# Altium schematic sheet Radio_USB.schdoc
size A3
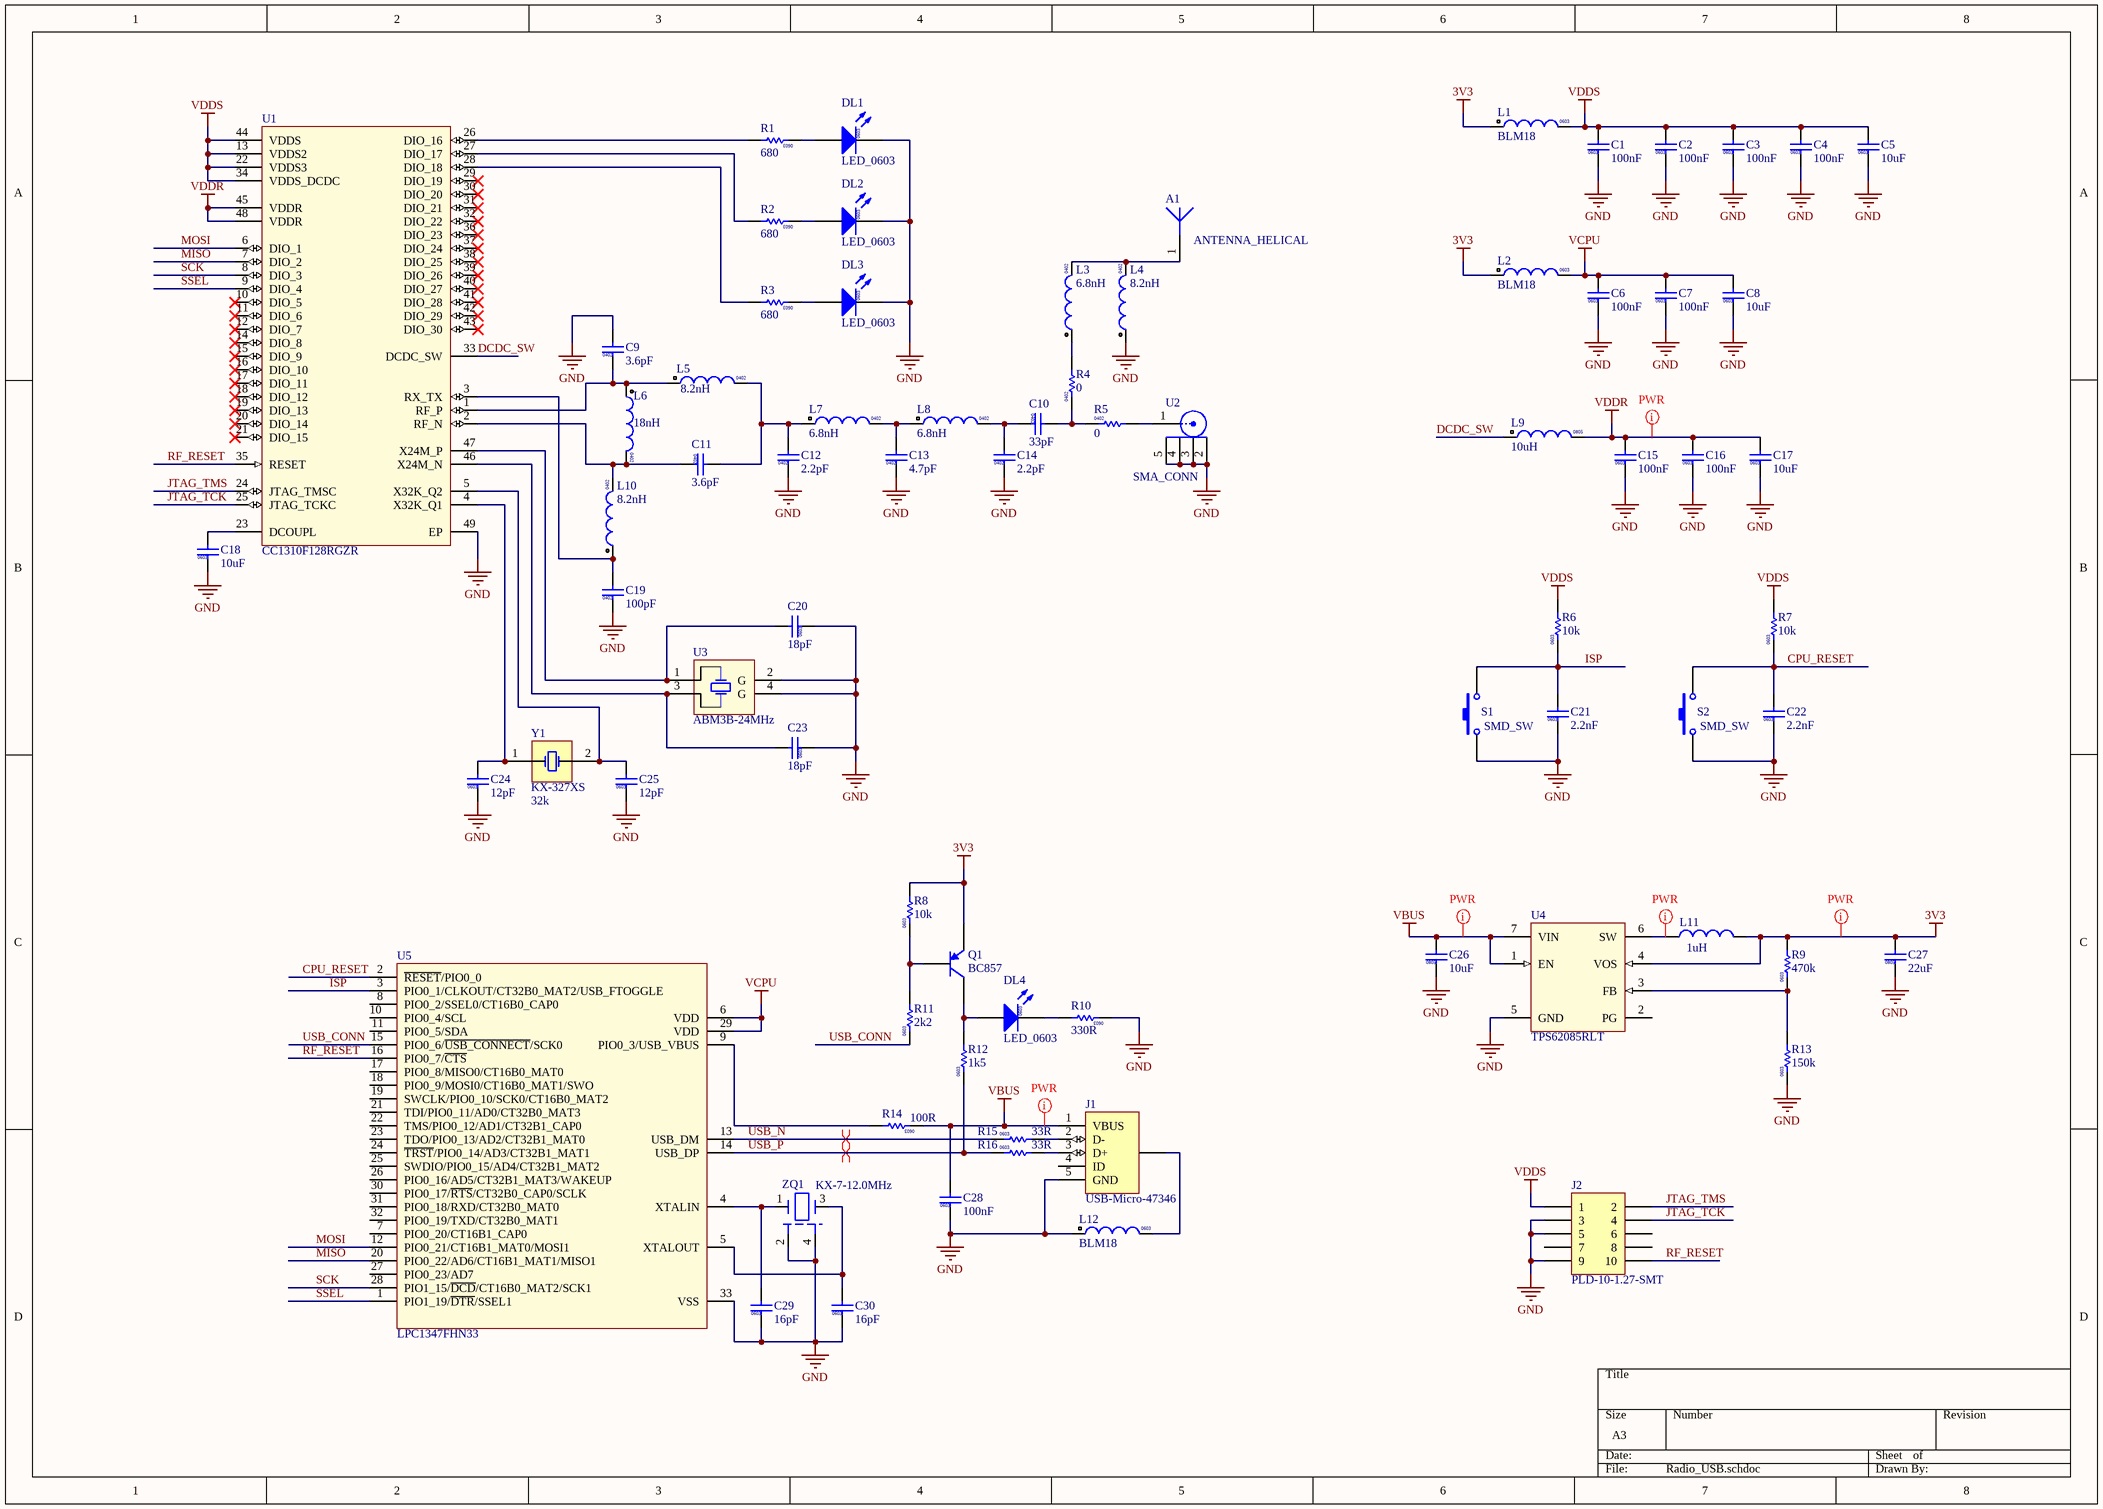
[diagram p0: Radio_USB.schdoc]

## Parts
A1  ANTENNA_HELICAL  [ANTENNA]
C1  value 100nF  [CAPC1608-0603M]  (hidden comment: CAPC_0603)
C2  value 100nF  [CAPC1608-0603M]  (hidden comment: CAPC_0603)
C3  value 100nF  [CAPC1608-0603M]  (hidden comment: CAPC_0603)
C4  value 100nF  [CAPC1608-0603M]  (hidden comment: CAPC_0603)
C5  value 10uF  [CAPC1608-0603M]  (hidden comment: CAPC_0603)
C6  value 100nF  [CAPC1608-0603M]  (hidden comment: CAPC_0603)
C7  value 100nF  [CAPC1608-0603M]  (hidden comment: CAPC_0603)
C8  value 10uF  [CAPC1608-0603M]  (hidden comment: CAPC_0603)
C9  value 3.6pF  [CAPC1005-0402M]  (hidden comment: CAPC_0402)
C10  value 33pF  [CAPC1005-0402M]  (hidden comment: CAPC_0402)
C11  value 3.6pF  [CAPC1005-0402M]  (hidden comment: CAPC_0402)
C12  value 2.2pF  [CAPC1005-0402M]  (hidden comment: CAPC_0402)
C13  value 4.7pF  [CAPC1005-0402M]  (hidden comment: CAPC_0402)
C14  value 2.2pF  [CAPC1005-0402M]  (hidden comment: CAPC_0402)
C15  value 100nF  [CAPC1608-0603M]  (hidden comment: CAPC_0603)
C16  value 100nF  [CAPC1608-0603M]  (hidden comment: CAPC_0603)
C17  value 10uF  [CAPC1608-0603M]  (hidden comment: CAPC_0603)
C18  value 10uF  [CAPC1608-0603M]  (hidden comment: CAPC_0603)
C19  value 100pF  [CAPC1005-0402M]  (hidden comment: CAPC_0402)
C20  value 18pF  [CAPC1608-0603M]  (hidden comment: CAPC_0603)
C21  value 2.2nF  [CAPC1608-0603M]  (hidden comment: CAPC_0603)
C22  value 2.2nF  [CAPC1608-0603M]  (hidden comment: CAPC_0603)
C23  value 18pF  [CAPC1608-0603M]  (hidden comment: CAPC_0603)
C24  value 12pF  [CAPC1608-0603M]  (hidden comment: CAPC_0603)
C25  value 12pF  [CAPC1608-0603M]  (hidden comment: CAPC_0603)
C26  value 10uF  [CAPC2012-0805M]  (hidden comment: CAPC_0805)
C27  value 22uF  [CAPC2012-0805M]  (hidden comment: CAPC_0805)
C28  value 100nF  [CAPC1608-0603M]  (hidden comment: CAPC_0603)
C29  value 16pF  [CAPC1608-0603M]  (hidden comment: CAPC_0603)
C30  value 16pF  [CAPC1608-0603M]  (hidden comment: CAPC_0603)
DL1  LED_0603  [DIODEC1608-0603]
DL2  LED_0603  [DIODEC1608-0603]
DL3  LED_0603  [DIODEC1608-0603]
DL4  LED_0603  [DIODEC1608-0603]
J1  USB-Micro-47346  [USB_micro_B]
J2  PLD-10-1.27-SMT  [PLD-10-1.27-SMT]
L1  value BLM18  [INDC1608M]  (hidden comment: INDC-0603)
L2  value BLM18  [INDC1608M]  (hidden comment: INDC-0603)
L3  value 6.8nH  [INDC1005-0402-RF2.4GHz]  (hidden comment: INDC-0402)
L4  value 8.2nH  [INDC1005-0402-RF2.4GHz]  (hidden comment: INDC-0402)
L5  value 8.2nH  [INDC1005-0402-RF2.4GHz]  (hidden comment: INDC-0402)
L6  value 18nH  [INDC1005-0402-RF2.4GHz]  (hidden comment: INDC-0402)
L7  value 6.8nH  [INDC1005-0402-RF2.4GHz]  (hidden comment: INDC-0402)
L8  value 6.8nH  [INDC1005-0402-RF2.4GHz]  (hidden comment: INDC-0402)
L9  value 10uH  [INDC2012M]  (hidden comment: INDC-0805)
L10  value 8.2nH  [INDC1005-0402-RF2.4GHz]  (hidden comment: INDC-0402)
L11  value 1uH  [XFL4015]  (hidden comment: XFL4015)
L12  value BLM18  [INDC1608M]  (hidden comment: INDC-0603)
Q1  BC857  [SOT23-3M]
R1  value 680  [RESC1608-0603M]  (hidden comment: RESC_0603)
R2  value 680  [RESC1608-0603M]  (hidden comment: RESC_0603)
R3  value 680  [RESC1608-0603M]  (hidden comment: RESC_0603)
R4  value 0  [RESC1005-0402M]  (hidden comment: RESC_0402)
R5  value 0  [RESC1005-0402M]  (hidden comment: RESC_0402)
R6  value 10k  [RESC1608-0603M]  (hidden comment: RESC_0603)
R7  value 10k  [RESC1608-0603M]  (hidden comment: RESC_0603)
R8  value 10k  [RESC1608-0603M]  (hidden comment: RESC_0603)
R9  value 470k  [RESC1608-0603M]  (hidden comment: RESC_0603)
R10  value 330R  [RESC1608-0603M]  (hidden comment: RESC_0603)
R11  value 2k2  [RESC1608-0603M]  (hidden comment: RESC_0603)
R12  value 1k5  [RESC1608-0603M]  (hidden comment: RESC_0603)
R13  value 150k  [RESC1608-0603M]  (hidden comment: RESC_0603)
R14  value 100R  [RESC1608-0603M]  (hidden comment: RESC_0603)
R15  value 33R  [RESC1608-0603M]  (hidden comment: RESC_0603)
R16  value 33R  [RESC1608-0603M]  (hidden comment: RESC_0603)
S1  SMD_SW  [SMD_SW_1]
S2  SMD_SW  [SMD_SW_1]
U1  CC1310F128RGZR  [QFN-48M]
U2  SMA_CONN  [SMA_CONN]
U3  ABM3B-24MHz  [ABM3B-24MHz]
U4  TPS62085RLT  [RLT7-0506]
U5  LPC1347FHN33  [HVQFN33_L]
Y1  KX-327XS  value 32k  [KX-327xs]
ZQ1  value KX-7-12.0MHz  [QRZ3.2x2.5]  (hidden comment: QRZ3.2x2.5)

## Nets
3V3: C27.2 L1.1 L2.1 L11.2 Q1.2(E) R8.2 R9.2 U4.4(VOS)
GND: C1.1 C2.1 C3.1 C4.1 C5.1 C6.1 C7.1 C8.1 C9.2 C12.1 C13.1 C14.1 C15.1 C16.1 C17.1 C18.1 C19.1 C20.1 C21.1 C22.1 C23.1 C24.1 C25.1 C26.1 C27.1 C28.1 C29.1 C30.1 DL1.2(K) DL2.2(K) DL3.2(K) J1.5(GND) J2.3 J2.5 J2.9 L4.1 L12.1 R10.1 R13.1 S1.1 S2.1 U1.49(EP) U2.2 U2.3 U2.4 U2.5 U3.2(G) U3.4(G) U4.5(GND) U5.33(VSS) ZQ1.2 ZQ1.4
VBUS: C26.2 C28.2 J1.1(VBUS) R14.1 U4.1(EN) U4.7(VIN)
VCPU: C6.2 C7.2 C8.2 L2.2 U5.6(VDD) U5.29(VDD)
VDDR: C15.2 C16.2 C17.2 L9.2 U1.45(VDDR) U1.48(VDDR)
VDDS: C1.2 C2.2 C3.2 C4.2 C5.2 J2.1 L1.2 R6.2 R7.2 U1.13(VDDS2) U1.22(VDDS3) U1.34(VDDS_DCDC) U1.44(VDDS)
CPU_RESET: C22.2 R7.1 S2.2 U5.2(~{RESET}/PIO0_0)
DCDC_SW: L9.1 U1.33(DCDC_SW)
ISP: C21.2 R6.1 S1.2 U5.3(PIO0_1/CLKOUT/CT32B0_MAT2/USB_FTOGGLE)
JTAG_TCK: J2.4 U1.25(JTAG_TCKC)
JTAG_TMS: J2.2 U1.24(JTAG_TMSC)
MISO: U1.7(DIO_2) U5.20(PIO0_22/AD6/CT16B1_MAT1/MISO1)
MOSI: U1.6(DIO_1) U5.12(PIO0_21/CT16B1_MAT0/MOSI1)
RF_RESET: J2.10 U1.35(RESET) U5.16(PIO0_7/~{CTS})
SCK: U1.8(DIO_3) U5.28(PIO1_15/~{DCD}/CT16B0_MAT2/SCK1)
SSEL: U1.9(DIO_4) U5.1(PIO1_19/~{DTR}/SSEL1)
USB_CONN: R11.1 U5.15(PIO0_6/~{USB_CONNECT}/SCK0)
USB_N: R15.1 U5.13(USB_DM)
USB_P: R12.1 R16.1 U5.14(USB_DP)
NetA1_1: A1.1 L3.2 L4.2
NetC9_1: C9.1 L5.1 L6.1 U1.1(RF_P)
NetC10_1: C10.1 C14.2 L8.2
NetC10_2: C10.2 R4.1 R5.1
NetC11_1: C11.1 L6.2 L10.2 U1.2(RF_N)
NetC11_2: C11.2 C12.2 L5.2 L7.1
NetC13_2: C13.2 L7.2 L8.1
NetC18_2: C18.2 U1.23(DCOUPL)
NetC19_2: C19.2 L10.1 U1.3(RX_TX)
NetC20_2: C20.2 U1.47(X24M_P) U3.1
NetC23_2: C23.2 U1.46(X24M_N) U3.3
NetC24_2: C24.2 U1.4(X32K_Q1) Y1.1
NetC25_2: C25.2 U1.5(X32K_Q2) Y1.2
NetC29_2: C29.2 U5.4(XTALIN) ZQ1.1
NetC30_2: C30.2 U5.5(XTALOUT) ZQ1.3
NetDL1_1: DL1.1(A) R1.1
NetDL2_1: DL2.1(A) R2.1
NetDL3_1: DL3.1(A) R3.1
NetDL4_1: DL4.1(A) Q1.3(C) R12.2
NetDL4_2: DL4.2(K) R10.2
NetJ1_2: J1.2(D-) R15.2
NetJ1_3: J1.3(D+) R16.2
NetJ1_SHIELD: J1.SHIELD(SHLD) L12.2
NetL3_1: L3.1 R4.2
NetL11_1: L11.1 U4.6(SW)
NetQ1_1: Q1.1(B) R8.1 R11.2
NetR1_2: R1.2 U1.26(DIO_16)
NetR2_2: R2.2 U1.27(DIO_17)
NetR3_2: R3.2 U1.28(DIO_18)
NetR5_2: R5.2 U2.1
NetR9_1: R9.1 R13.2 U4.3(FB)
NetR14_2: R14.2 U5.9(PIO0_3/USB_VBUS)

Not connected (* = marked no-connect by the designer): J1 4(ID); J2 6 7 8; U1 10(DIO_5)* 11(DIO_6)* 12(DIO_7)* 14(DIO_8)* 15(DIO_9)* 16(DIO_10)* 17(DIO_11)* 18(DIO_12)* 19(DIO_13)* 20(DIO_14)* 21(DIO_15)* 29(DIO_19)* 30(DIO_20)* 31(DIO_21)* 32(DIO_22)* 36(DIO_23)* 37(DIO_24)* 38(DIO_25)* 39(DIO_26)* 40(DIO_27)* 41(DIO_28)* 42(DIO_29)* 43(DIO_30)*; U4 2(PG); U5 7(PIO0_20/CT16B1_CAP0) 8(PIO0_2/SSEL0/CT16B0_CAP0) 10(PIO0_4/SCL) 11(PIO0_5/SDA) 17(PIO0_8/MISO0/CT16B0_MAT0) 18(PIO0_9/MOSI0/CT16B0_MAT1/SWO) 19(SWCLK/PIO0_10/SCK0/CT16B0_MAT2) 21(TDI/PIO0_11/AD0/CT32B0_MAT3) 22(TMS/PIO0_12/AD1/CT32B1_CAP0) 23(TDO/PIO0_13/AD2/CT32B1_MAT0) 24(~{TRST}/PIO0_14/AD3/CT32B1_MAT1) 25(SWDIO/PIO0_15/AD4/CT32B1_MAT2) 26(PIO0_16/AD5/CT32B1_MAT3/WAKEUP) 27(PIO0_23/AD7) 30(PIO0_17/~{RTS}/CT32B0_CAP0/SCLK) 31(PIO0_18/RXD/CT32B0_MAT0) 32(PIO0_19/TXD/CT32B0_MAT1)

## Layout directives
differential pair: USB_N, USB_P
net class PWR: 3V3, NetL11_1, VBUS, VDDR

## Notes on the sheet
- (in symbol CAPC_0402) 0402
- (in symbol CAPC_0603) 0603
- (in symbol CAPC_0805) 0805
- (in symbol INDC-0603) 0603
- (in symbol INDC-0805) 0805
- (in symbol LED_0603) 0603
- (in symbol RESC_0402) 0402
- (in symbol RESC_0603) 0603

## Library data of the parts
A1 = ANTENNA_HELICAL: PCB helical antenna
C1-C8 C15-C18 C20-C25 C28-C30 = CAPC_0603: Capacitor 0603
C9-C14 C19 = CAPC_0402: Capacitor 0402
C26 C27 = CAPC_0805: Capacitor 0805
DL1-DL4 = LED_0603: LED 0603; Part number: *BL-...; Color: Red
J1 = USB-Micro-47346: Micro USB B Molex 47346; ComponentLink1Description: Manufacturer Link; ComponentLink1URL: http://www.tycoelectronics.com/
L1 L2 L12 = INDC-0603: Chip Inductor, Body Body 1.6x0.8mm
L3-L8 L10 = INDC-0402: Chip Inductor, Body 1.0x0.5mm; Code_IEC: 1005; Published: 8-Jun-2000; LatestRevisionDate: 17-Jul-2002; LatestRevisionNote: Re-released for DXP Platform.; PackageReference: 0402-A; Publisher: Altium Limited; Code_JEITA: 0402
L9 = INDC-0805: Chip Inductor, Body Body 2.0x1.2mm
L11 = XFL4015: Power Inductors; PartNumber: XFL4020-102MEC; Store: http://www.compel.ru/?s=XFL4020
Q1 = BC857: BC857 PNP Transistor
R1-R3 R6-R16 = RESC_0603: Resistor 0603
R4 R5 = RESC_0402: Resistor 0402
S1 S2 = SMD_SW: Switch; Published: 24-Mar-1999; LatestRevisionDate: 17-Jul-2002; LatestRevisionNote: Re-released for DXP Platform.; PackageReference: SPST-2; Publisher: Altium Limited
U1 = CC1310F128RGZR: Ultralow Power Sub-1-GHz Wireless MCU
U2 = SMA_CONN: SMA Straight PCB Socket
U3 = ABM3B-24MHz: Crystal Oscillator, 24 MHz, SMD, 5mm x 3.2mm
U4 = TPS62085RLT: Step-Down Converter With Hiccup Short-Circuit Protection, 2.5-V to 6.0-V input Voltage Range
U5 = LPC1347FHN33: NXP 32-bit ARM Cortex-M3; Store: http://www.digikey.com/product-search/en/integrated-circuits-ics/embedded-microcontrollers/2556109?k=lpc1347; Datasheet: http://www.nxp.com/documents/data_sheet/LPC1315_16_17_45_46_47.pdf
Y1 = KX-327XS: Surface Mount Quartz Crystal
ZQ1 = QRZ3.2x2.5: Quartz SMD 3.2*2.5 mm body 4 pads
J2 = PLD-10-1.27-SMT: LatestRevisionDate: 17-Jul-2002; LatestRevisionNote: Re-released for DXP Platform.; Publisher: Altium Limited